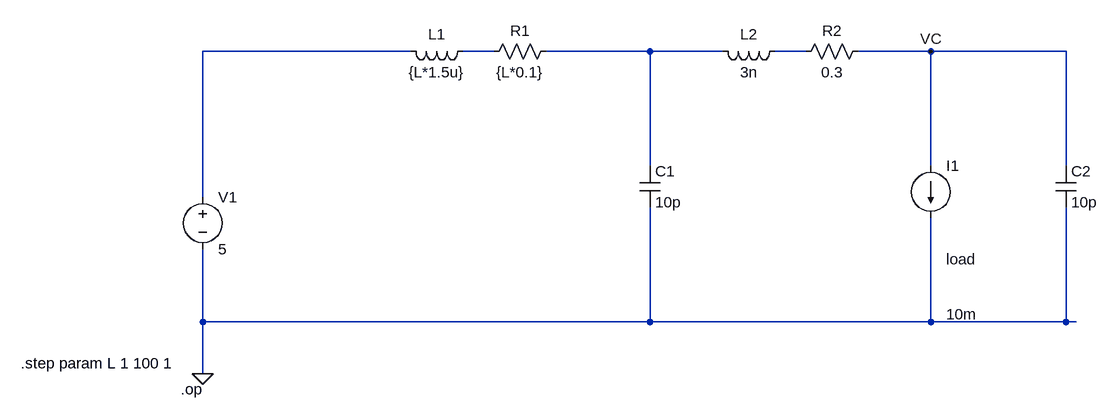
[diagram p0: schematic 2a.asc]
2a.asc, the LTspice schematic file:
Version 4
SHEET 1 880 680
WIRE -928 -176 -1248 -176
WIRE -800 -176 -848 -176
WIRE -560 -176 -720 -176
WIRE -448 -176 -560 -176
WIRE -320 -176 -368 -176
WIRE -128 -176 -240 -176
WIRE 80 -176 -128 -176
WIRE -560 0 -560 -176
WIRE -128 0 -128 -176
WIRE 80 0 80 -176
WIRE -1248 48 -1248 -176
WIRE -1248 240 -1248 128
WIRE -560 240 -560 64
WIRE -560 240 -1248 240
WIRE -128 240 -128 80
WIRE -128 240 -560 240
WIRE 80 240 80 64
WIRE 80 240 -128 240
WIRE 96 240 80 240
WIRE -1248 320 -1248 240
FLAG -1248 320 0
FLAG -128 -176 VC
SYMBOL voltage -1248 32 R0
WINDOW 123 0 0 Left 0
WINDOW 39 0 0 Left 0
SYMATTR InstName V1
SYMATTR Value 5
SYMBOL ind -832 -192 R90
WINDOW 0 5 56 VBottom 0
WINDOW 3 32 56 VTop 0
SYMATTR InstName L1
SYMATTR Value {L*1.5u}
SYMBOL res -704 -192 R90
WINDOW 0 0 56 VBottom 0
WINDOW 3 32 56 VTop 0
SYMATTR InstName R1
SYMATTR Value {L*0.1}
SYMBOL cap -576 0 R0
SYMATTR InstName C1
SYMATTR Value 10p
SYMBOL ind -352 -192 R90
WINDOW 0 5 56 VBottom 0
WINDOW 3 32 56 VTop 0
SYMATTR InstName L2
SYMATTR Value 3n
SYMBOL res -224 -192 R90
WINDOW 0 0 56 VBottom 0
WINDOW 3 32 56 VTop 0
SYMATTR InstName R2
SYMATTR Value 0.3
SYMBOL cap 64 0 R0
SYMATTR InstName C2
SYMATTR Value 10p
SYMBOL current -128 0 R0
WINDOW 3 24 228 Left 0
WINDOW 123 24 200 Left 0
WINDOW 39 24 144 Left 0
SYMATTR InstName I1
SYMATTR Value 10m
SYMATTR SpiceLine load
TEXT -1282 344 Left 0 !.op
TEXT -1528 304 Left 0 !.step param L 1 100 1

The netlist it stands for:
* 2a.asc
V1 N001 0 5
L1 N002 N001 {L*1.5u}
R1 N003 N002 {L*0.1}
C1 N003 0 10p
L2 N004 N003 3n
R2 VC N004 0.3
C2 VC 0 10p
I1 VC 0 10m load
.op
.step param L 1 100 1
.backanno
.end